# EAGLE schematic Multicell Battery Load Analyzer (EAGLE 9.7.0)

## Sheet 1 of 5
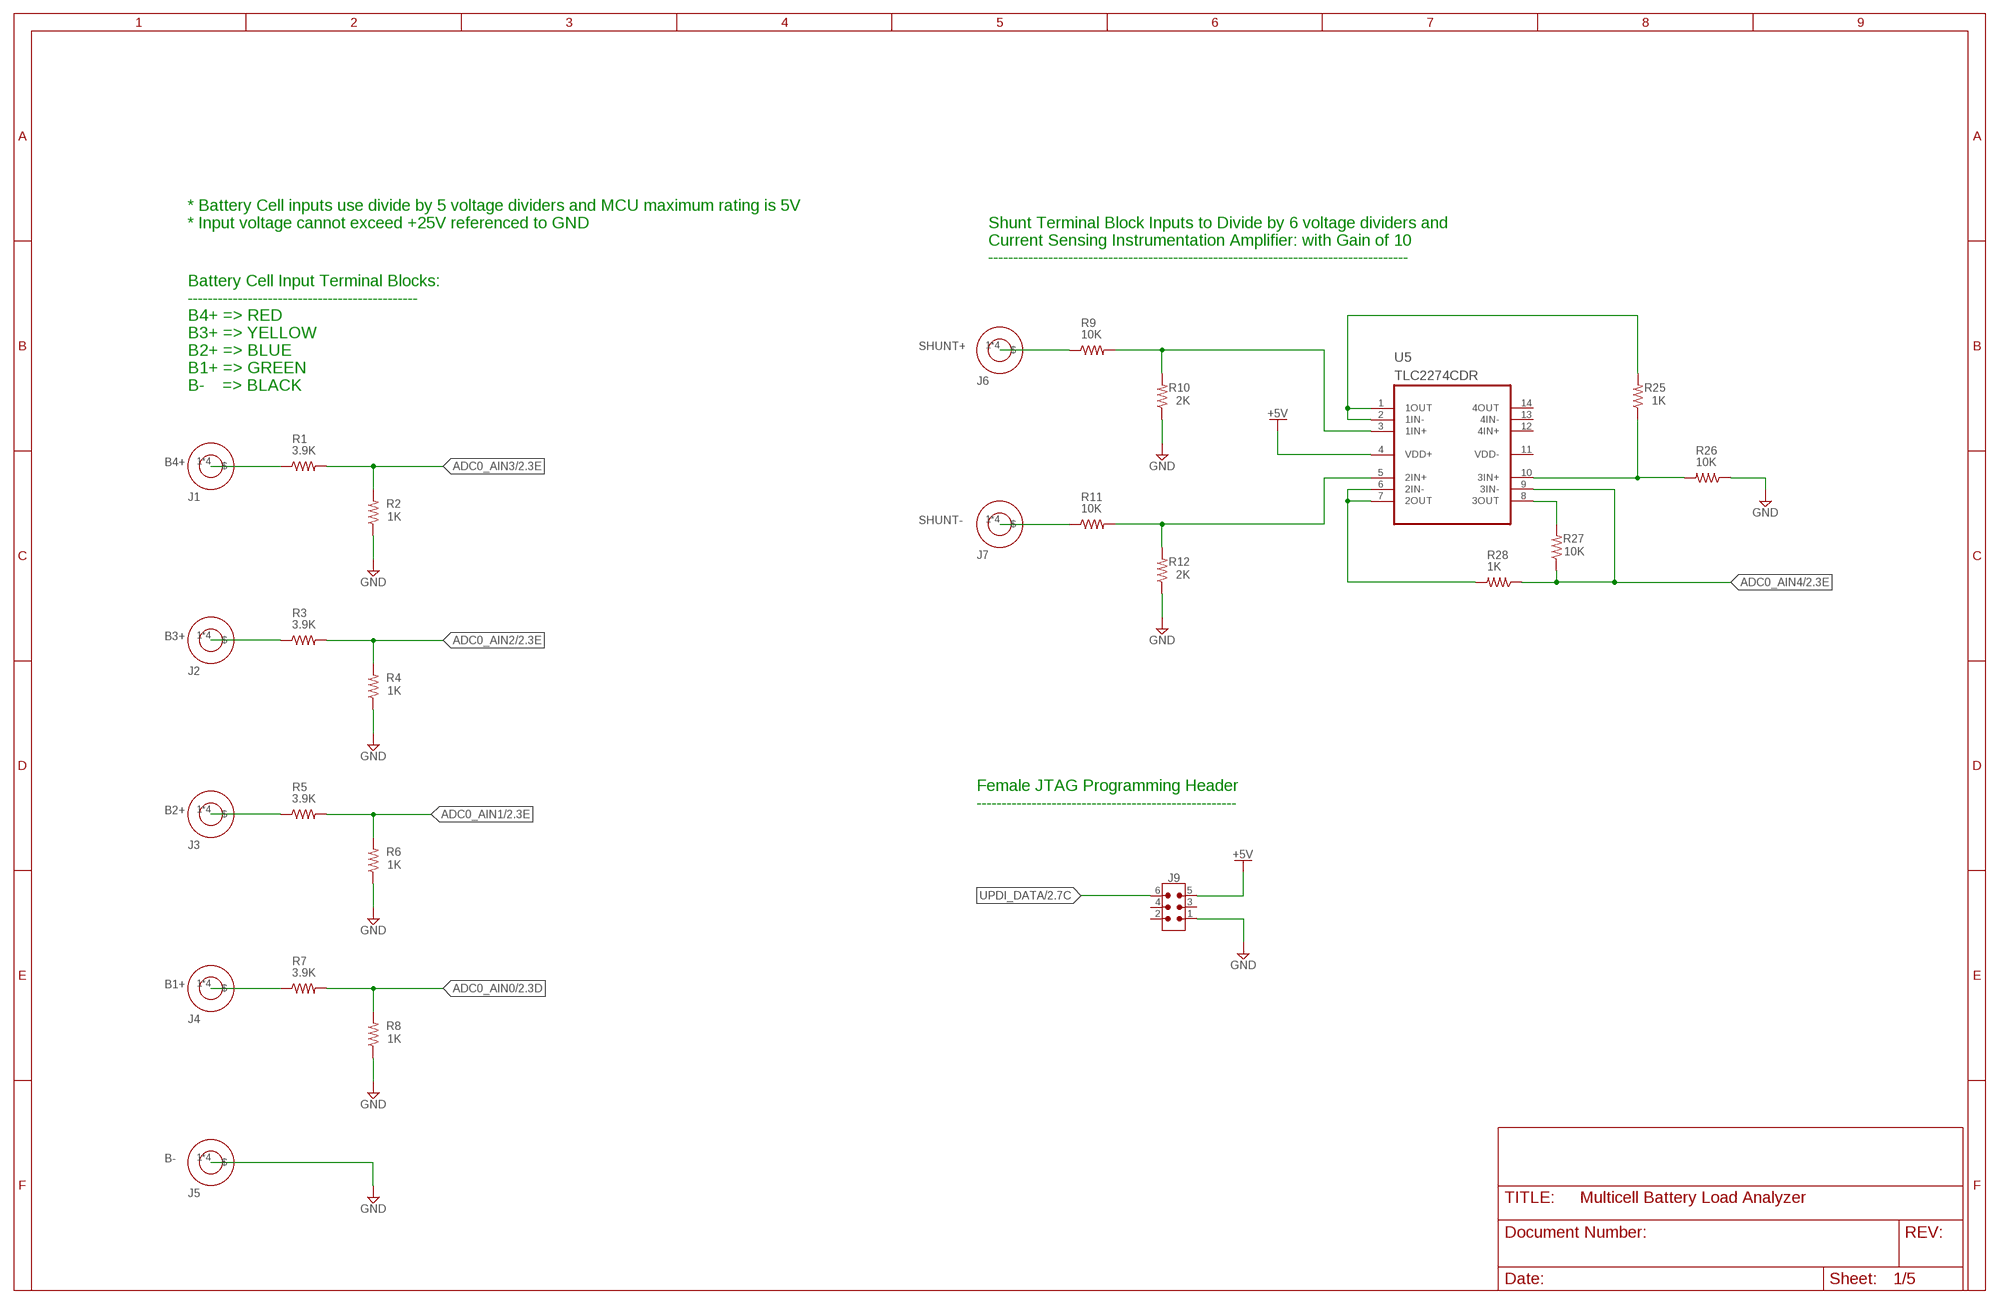
[diagram p0: schematic, sheet 1]

### Parts
J1  7785  [KEYSTONE_7785]
J2  7785  [KEYSTONE_7785]
J3  7785  [KEYSTONE_7785]
J4  7785  [KEYSTONE_7785]
J5  7785  [KEYSTONE_7785]
J6  7785  [KEYSTONE_7785]
J7  7785  [KEYSTONE_7785]
J9  61200621621  6120XX21621_61200621621  [61200621621]
R1  3.9K  R-US_R0805  [R0805]
R2  1K  R-US_R0805  [R0805]
R3  3.9K  R-US_R0805  [R0805]
R4  1K  R-US_R0805  [R0805]
R5  3.9K  R-US_R0805  [R0805]
R6  1K  R-US_R0805  [R0805]
R7  3.9K  R-US_R0805  [R0805]
R8  1K  R-US_R0805  [R0805]
R9  10K  R-US_R0805  [R0805]
R10  2K  R-US_R0805  [R0805]
R11  10K  R-US_R0805  [R0805]
R12  2K  R-US_R0805  [R0805]
R25  1K  R-US_R0805  [R0805]
R26  10K  R-US_R0805  [R0805]
R27  10K  R-US_R0805  [R0805]
R28  1K  R-US_R0805  [R0805]
U5  TLC2274CDR  [SOIC127P600X175-14N]

### Nets
+5V: J9.5 U5.4(VDD+) ; also sheet 2,3,4
ADC0_AIN0: R7.2 R8.2 ; also sheet 2
ADC0_AIN1: R5.2 R6.2 ; also sheet 2
ADC0_AIN2: R3.2 R4.2 ; also sheet 2
ADC0_AIN3: R1.2 R2.2 ; also sheet 2
ADC0_AIN4: R27.1 R28.1 U5.9(3IN-) ; also sheet 2
B1+: J4.1($) J4.2($) J4.3($) J4.4($) R7.1
B2+: J3.1($) J3.2($) J3.3($) J3.4($) R5.1
B3+: J2.1($) J2.2($) J2.3($) J2.4($) R3.1
B4+: J1.1($) J1.2($) J1.3($) J1.4($) R1.1
B-: J5.1($) J5.2($) J5.3($) J5.4($) ; supply symbol labelled GND
GND: J9.1 R2.1 R4.1 R6.1 R8.1 R10.1 R12.1 R26.1 ; also sheet 2,3,4,5
N$11: R9.2 R10.2 U5.3(1IN+)
N$12: R11.2 R12.2 U5.5(2IN+)
N$13: R25.2 U5.1(1OUT) U5.2(1IN-)
N$14: R28.2 U5.6(2IN-) U5.7(2OUT)
N$15: R25.1 R26.2 U5.10(3IN+)
N$19: R27.2 U5.8(3OUT)
SHUNT+: J6.1($) J6.2($) J6.3($) J6.4($) R9.1
SHUNT-: J7.1($) J7.2($) J7.3($) J7.4($) R11.1
UPDI_DATA: J9.6 ; also sheet 2
Unconnected: J9.2 J9.3 J9.4 U5.12(4IN+) U5.13(4IN-) U5.14(4OUT)

### Notes on the sheet
- * Battery Cell inputs use divide by 5 voltage dividers and MCU maximum rating is 5V
  * Input voltage cannot exceed +25V referenced to GND
- Shunt Terminal Block Inputs to Divide by 6 voltage dividers and 
  Current Sensing Instrumentation Amplifier: with Gain of 10
  ------------------------------------------------------------------------------------
- Battery Cell Input Terminal Blocks:
  ----------------------------------------------
  B4+ => RED
  B3+ => YELLOW
  B2+ => BLUE
  B1+ => GREEN
  B-    => BLACK
- Female JTAG Programming Header
  ----------------------------------------------------

## Sheet 2 of 5
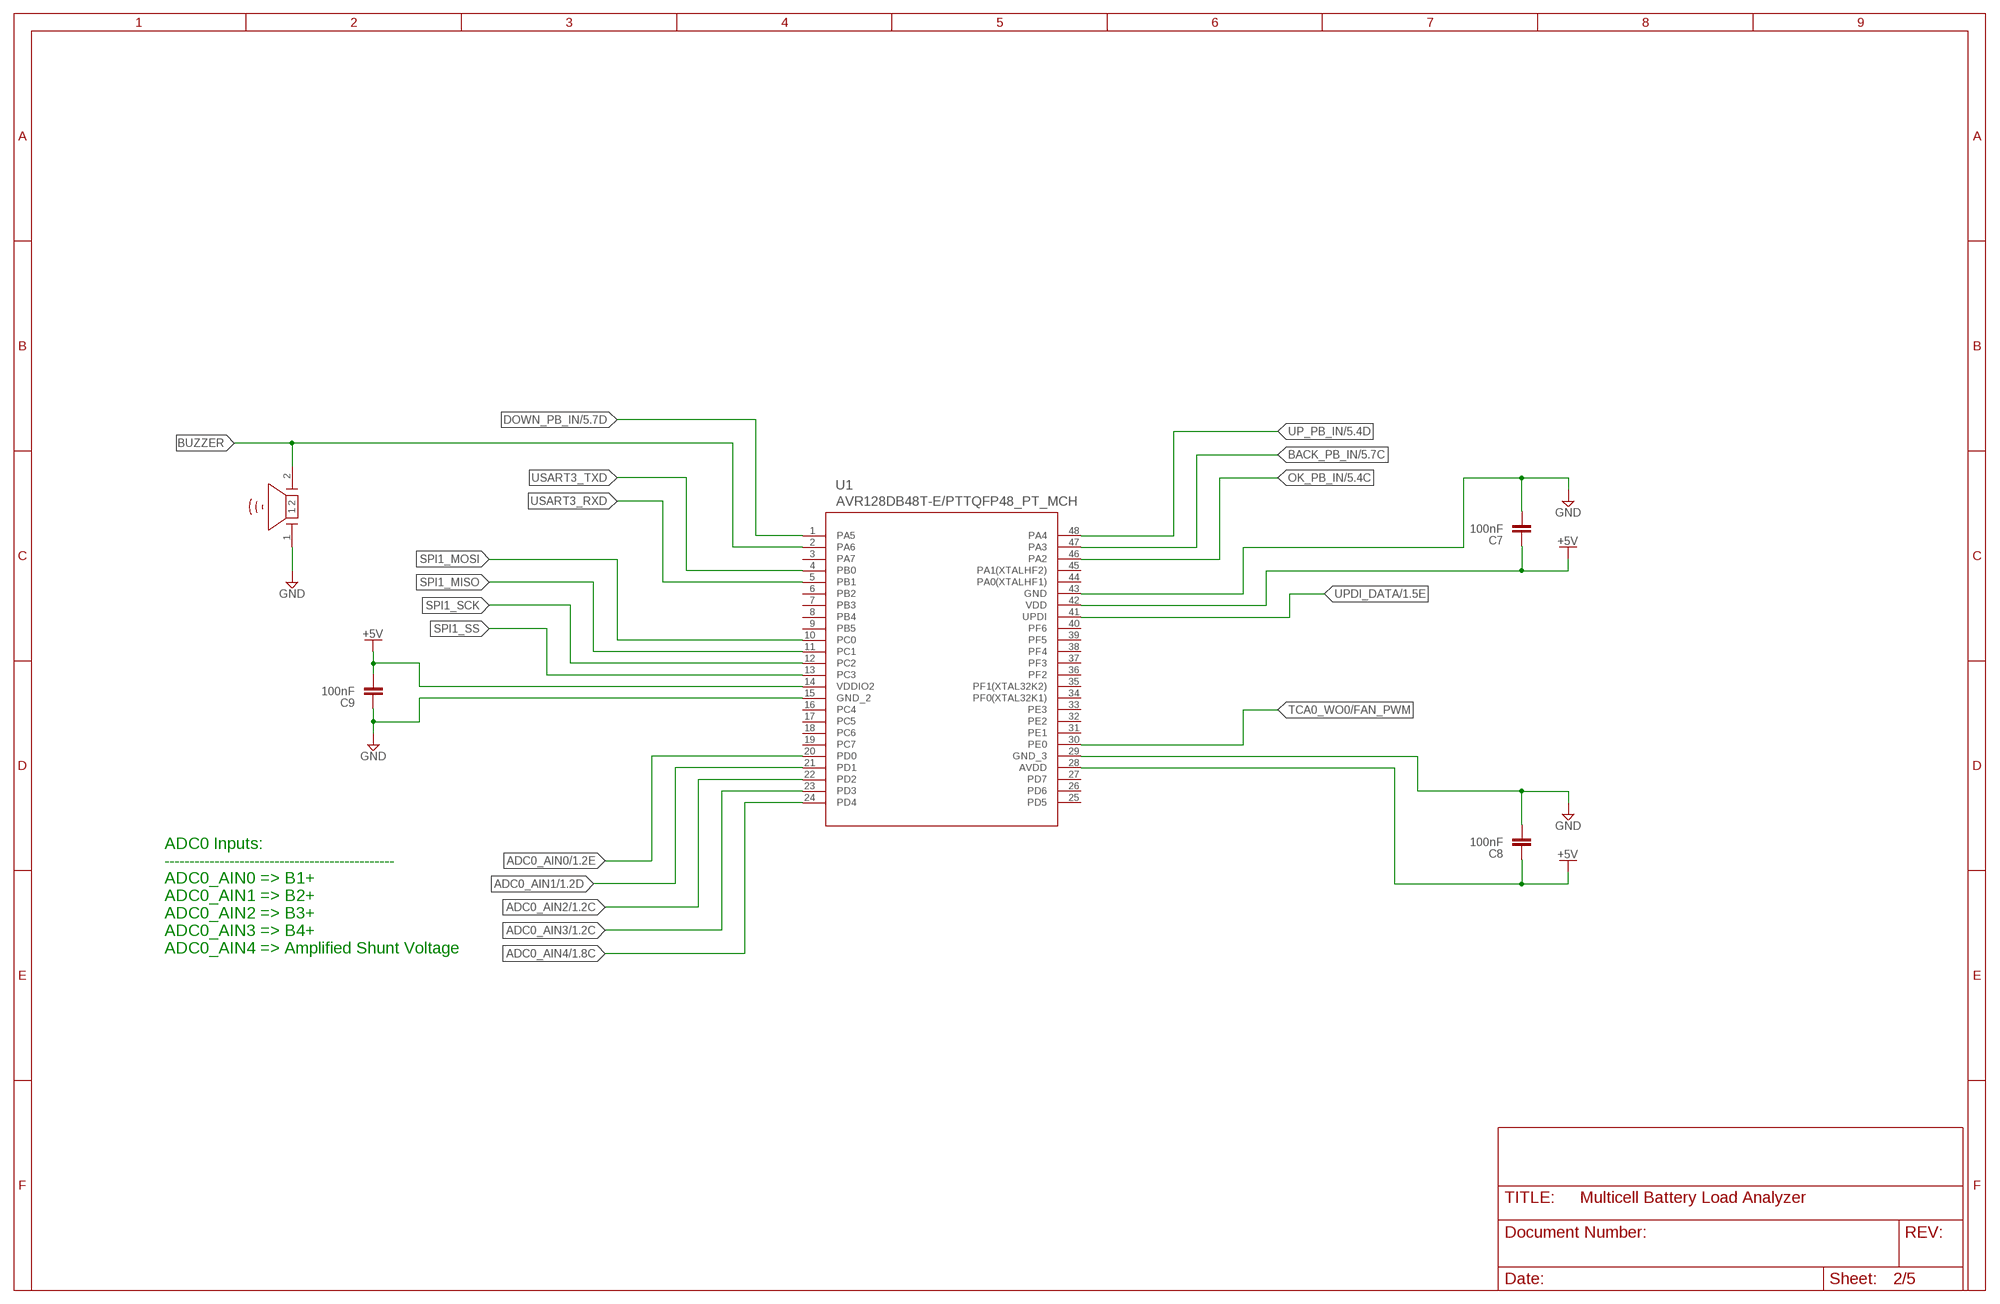
[diagram p1: schematic, sheet 2]

### Parts
C7  100nF  C-EUC0805  [C0805]
C8  100nF  C-EUC0805  [C0805]
C9  100nF  C-EUC0805  [C0805]
LS1  PIEZO  [PIEZO]
U1  AVR128DB48T-E/PTTQFP48_PT_MCH  [TQFP48_PT_MCH]

### Nets
+5V: C7.1 C8.1 C9.2 U1.14(VDDIO2) U1.28(AVDD) U1.42(VDD) ; also sheet 1,3,4
ADC0_AIN0: U1.20(PD0) ; also sheet 1
ADC0_AIN1: U1.21(PD1) ; also sheet 1
ADC0_AIN2: U1.22(PD2) ; also sheet 1
ADC0_AIN3: U1.23(PD3) ; also sheet 1
ADC0_AIN4: U1.24(PD4) ; also sheet 1
BACK_PB_IN: U1.47(PA3) ; also sheet 5
BUZZER: LS1.2 U1.2(PA6)
DOWN_PB_IN: U1.1(PA5) ; also sheet 5
GND: C7.2 C8.2 C9.1 LS1.1 U1.15(GND_2) U1.29(GND_3) U1.43(GND) ; also sheet 1,3,4,5
OK_PB_IN: U1.46(PA2) ; also sheet 5
SPI1_MISO: U1.11(PC1)
SPI1_MOSI: U1.10(PC0)
SPI1_SCK: U1.12(PC2)
SPI1_SS: U1.13(PC3)
TCA0_WO0/FAN_PWM: U1.30(PE0)
UP_PB_IN: U1.48(PA4) ; also sheet 5
UPDI_DATA: U1.41(UPDI) ; also sheet 1
USART3_RXD: U1.5(PB1)
USART3_TXD: U1.4(PB0)
Unconnected: U1.3(PA7) U1.6(PB2) U1.7(PB3) U1.8(PB4) U1.9(PB5) U1.16(PC4) U1.17(PC5) U1.18(PC6) U1.19(PC7) U1.25(PD5) U1.26(PD6) U1.27(PD7) U1.31(PE1) U1.32(PE2) U1.33(PE3) U1.34(PF0(XTAL32K1)) U1.35(PF1(XTAL32K2)) U1.36(PF2) U1.37(PF3) U1.38(PF4) U1.39(PF5) U1.40(PF6) U1.44(PA0(XTALHF1)) U1.45(PA1(XTALHF2))

### Notes on the sheet
- ADC0 Inputs:
  ----------------------------------------------
  ADC0_AIN0 => B1+
  ADC0_AIN1 => B2+
  ADC0_AIN2 => B3+
  ADC0_AIN3 => B4+
  ADC0_AIN4 => Amplified Shunt Voltage

## Sheet 3 of 5
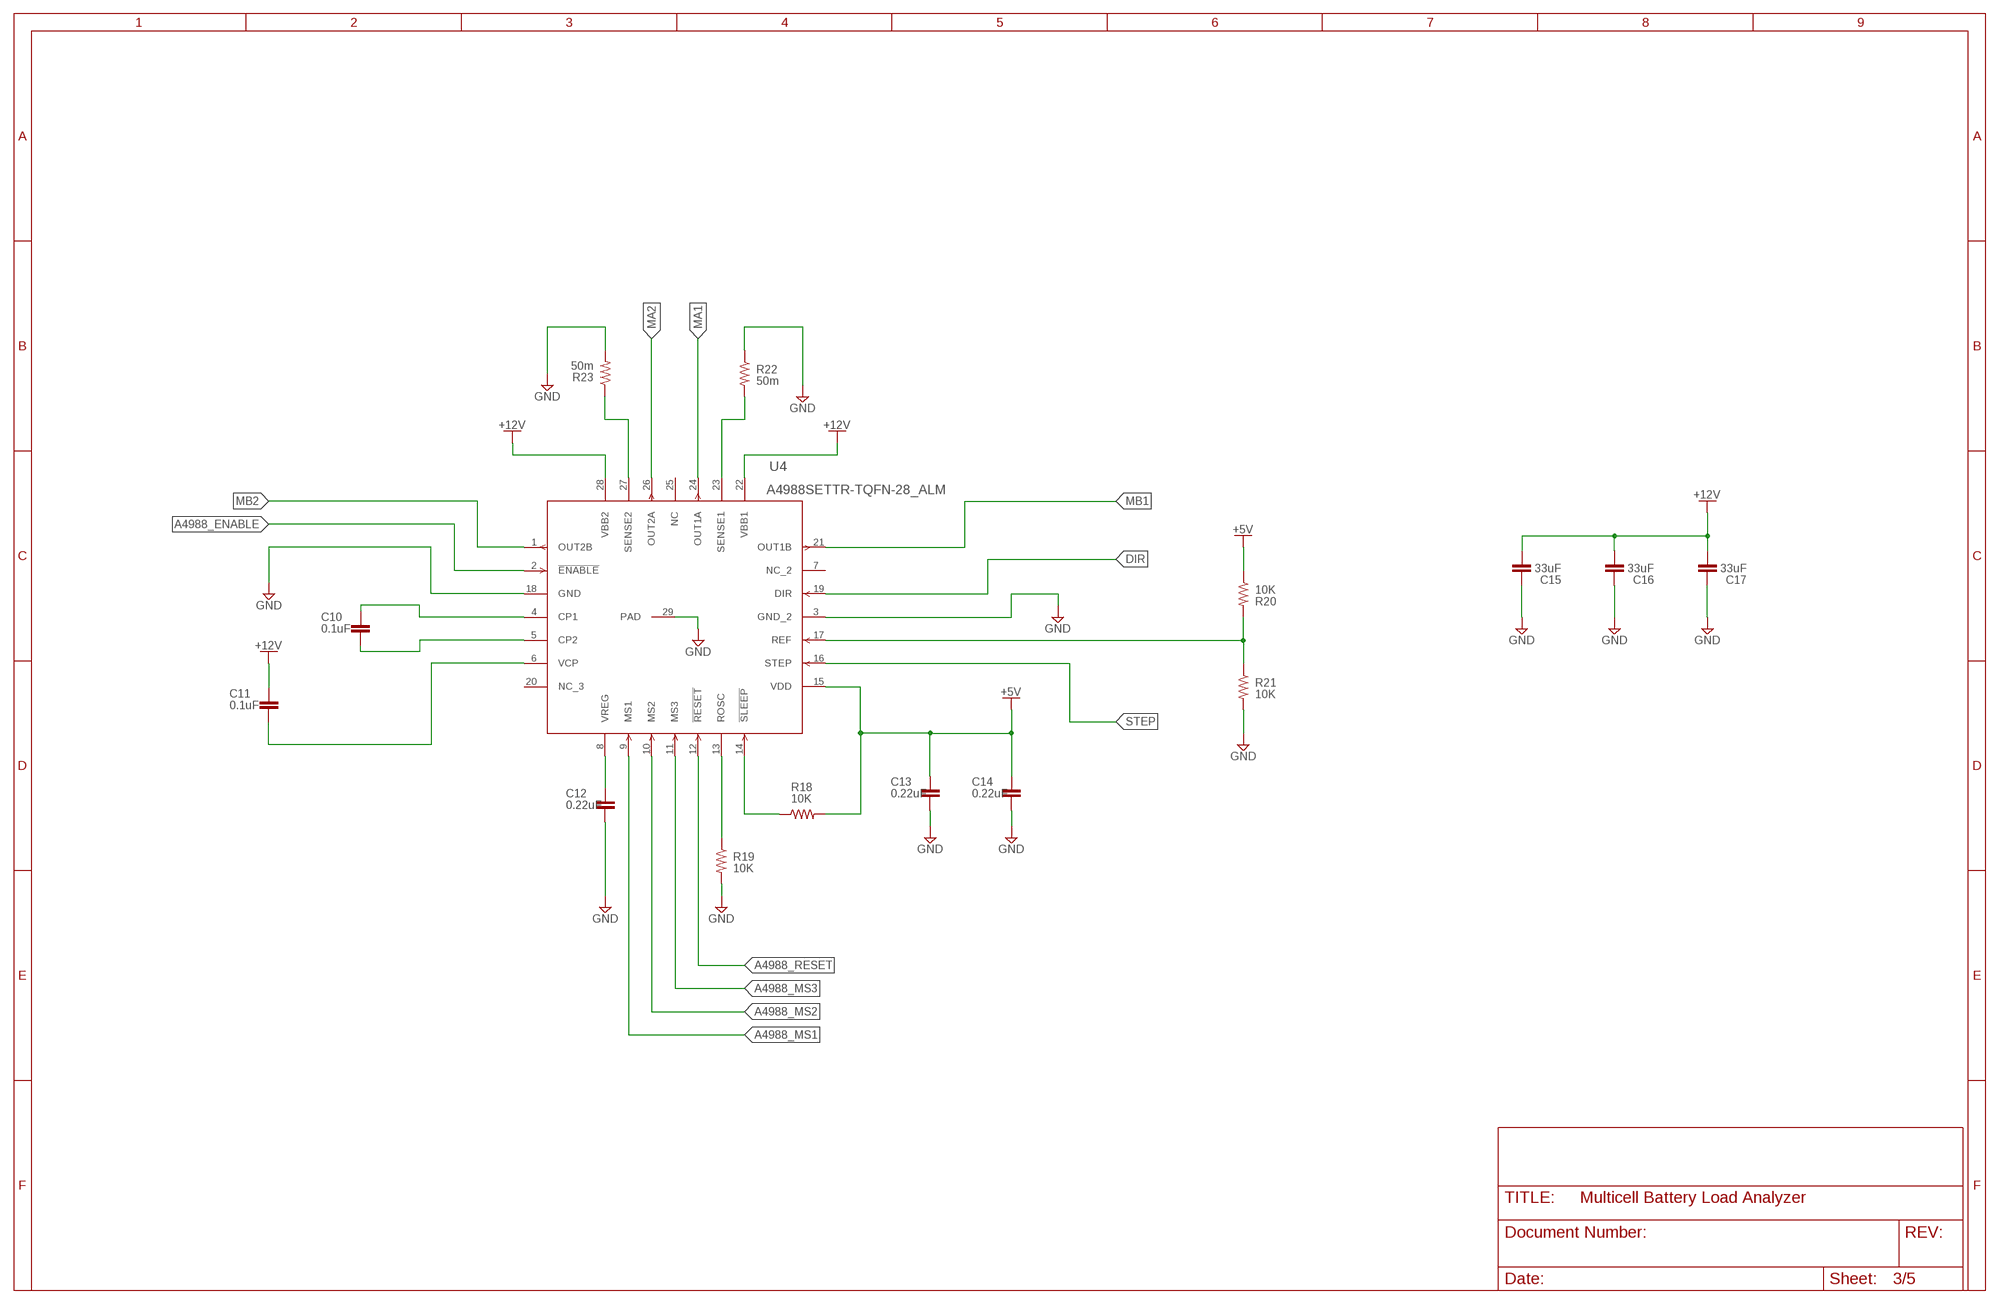
[diagram p2: schematic, sheet 3]

### Parts
C10  0.1uF  C-EUC0805  [C0805]
C11  0.1uF  C-EUC0805  [C0805]
C12  0.22uF  C-EUC0805  [C0805]
C13  0.22uF  C-EUC0805  [C0805]
C14  0.22uF  C-EUC0805  [C0805]
C15  33uF  C-EUC0805  [C0805]
C16  33uF  C-EUC0805  [C0805]
C17  33uF  C-EUC0805  [C0805]
R18  10K  R-US_R0805  [R0805]
R19  10K  R-US_R0805  [R0805]
R20  10K  R-US_R0805  [R0805]
R21  10K  R-US_R0805  [R0805]
R22  50m  R-US_R0805  [R0805]
R23  50m  R-US_R0805  [R0805]
U4  A4988SETTR-TQFN-28_ALM  [QFN-28_ALM]

### Nets
+5V: C13.1 C14.1 R18.2 R20.1 U4.15(VDD) ; also sheet 1,2,4
+12V: C11.1 C15.2 C16.2 C17.2 U4.22(VBB1) U4.28(VBB2) ; also sheet 4
A4988_ENABLE: U4.2(!ENABLE)
A4988_MS1: U4.9(MS1)
A4988_MS2: U4.10(MS2)
A4988_MS3: U4.11(MS3)
A4988_RESET: U4.12(!RESET)
DIR: U4.19(DIR)
GND: C12.2 C13.2 C14.2 C15.1 C16.1 C17.1 R19.2 R21.2 R22.1 R23.2 U4.3(GND_2) U4.18(GND) U4.29(PAD) ; also sheet 1,2,4,5
MA1: U4.24(OUT1A)
MA2: U4.26(OUT2A)
MB1: U4.21(OUT1B)
MB2: U4.1(OUT2B)
N$8: C10.1 U4.4(CP1)
N$9: C10.2 U4.5(CP2)
N$16: R19.1 U4.13(ROSC)
N$17: R18.1 U4.14(!SLEEP)
N$18: C12.1 U4.8(VREG)
N$20: R23.1 U4.27(SENSE2)
N$21: R22.2 U4.23(SENSE1)
N$27: R20.2 R21.1 U4.17(REF)
N$29: C11.2 U4.6(VCP)
STEP: U4.16(STEP)
Unconnected: U4.7(NC_2) U4.20(NC_3) U4.25(NC)

## Sheet 4 of 5
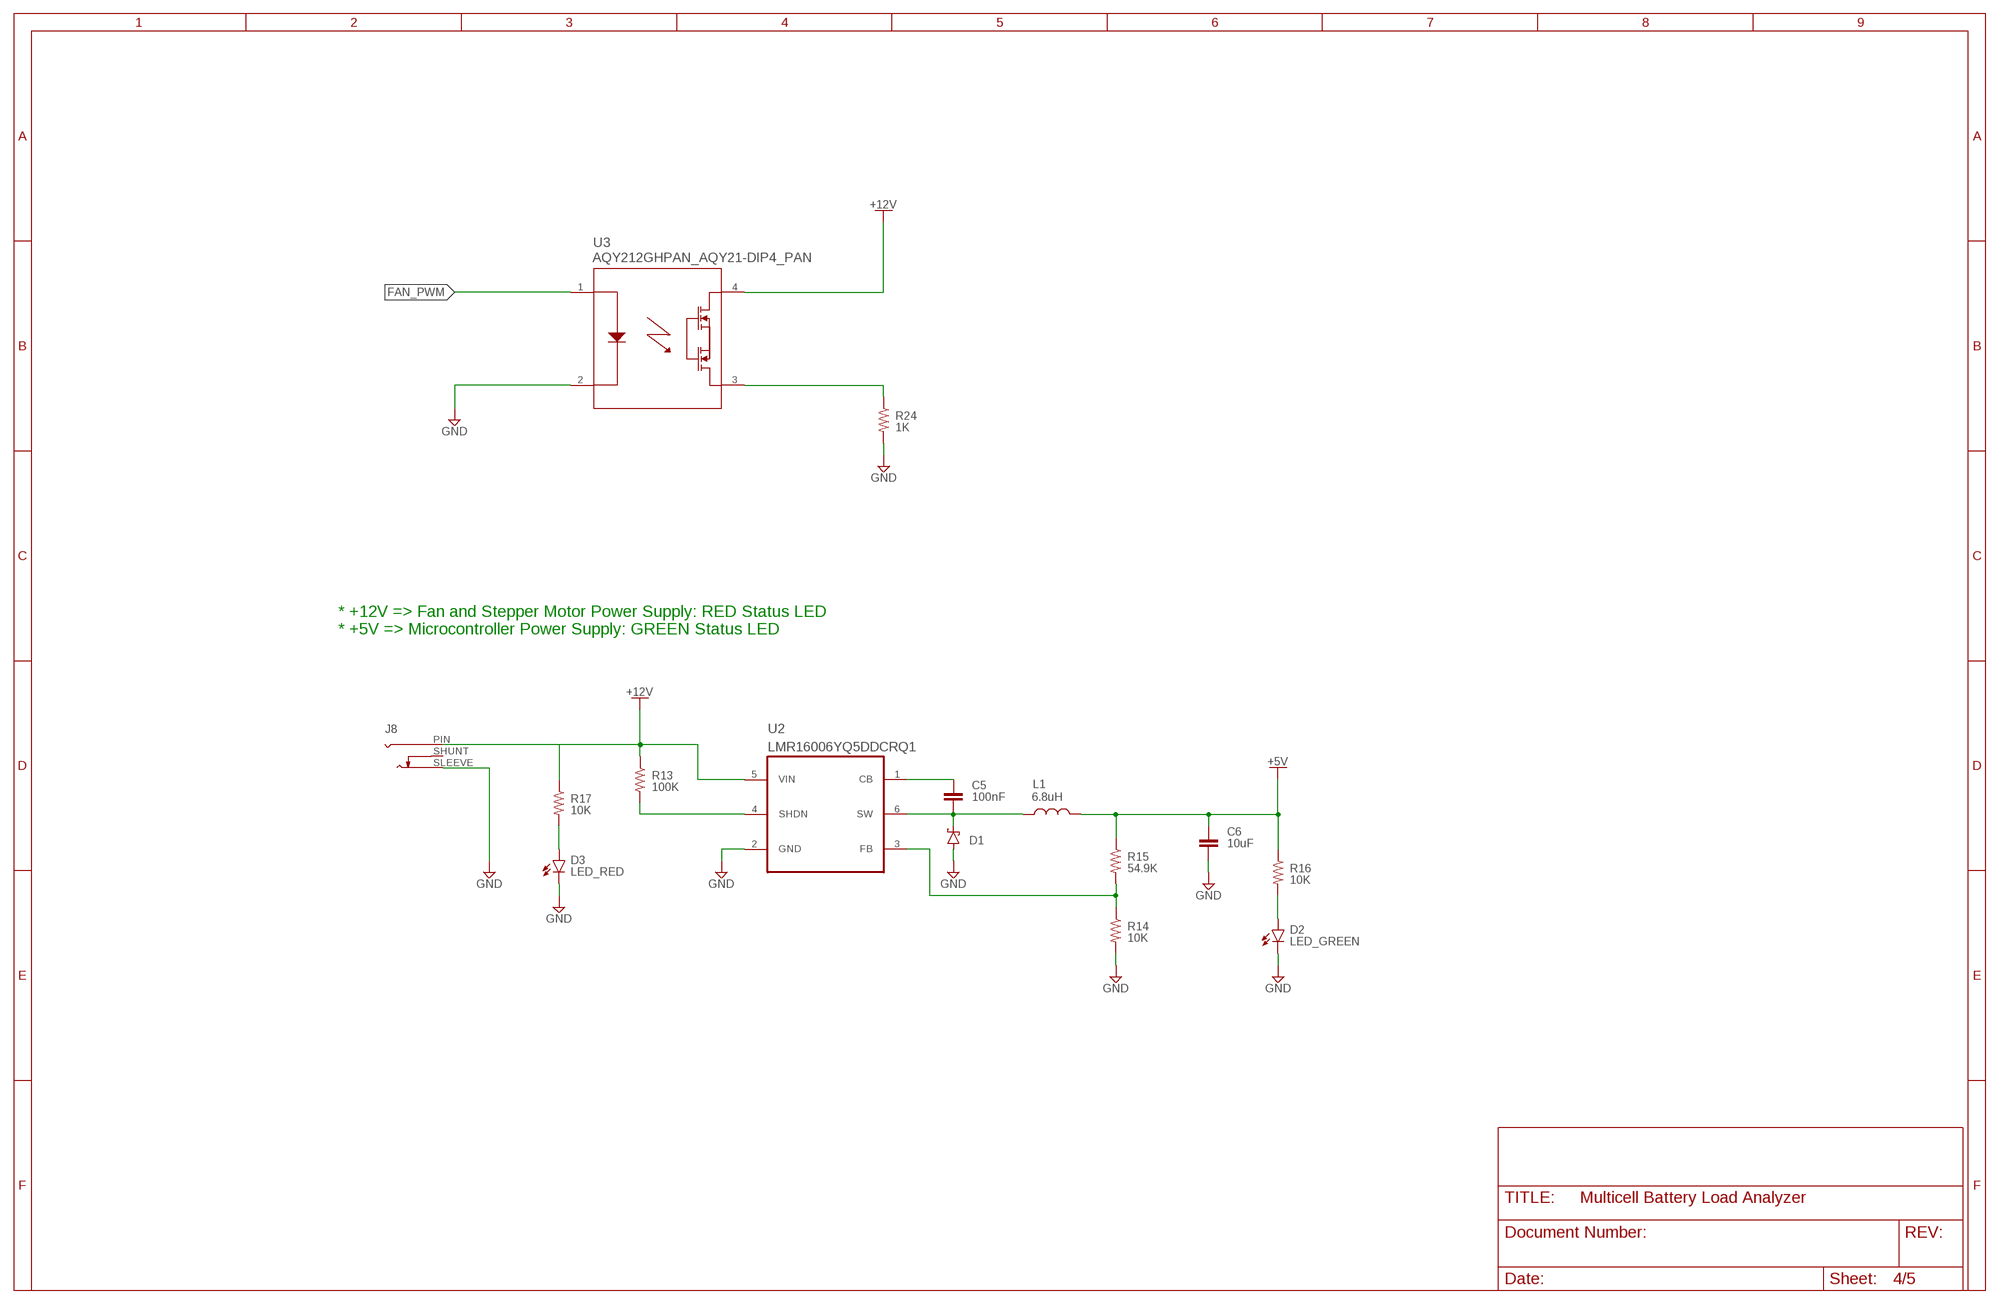
[diagram p3: schematic, sheet 4]

### Parts
C5  100nF  C-EUC0805  [C0805]
C6  10uF  C-EUC0805  [C0805]
D1  MBR0520LT1G  SCHOTTKY_MBR0520LT1GDO-219  [SODFL3718X115]
D2  LED_GREEN  CHIP-FLAT-G_0805  [LEDC2012X110N_FLAT-G]
D3  LED_RED  CHIP-FLAT-R_0805  [LEDC2012X110N_FLAT-R]
J8  RASM712BKZ  [SWITCHCRAFT_RASM712BKZ]
L1  6.8uH  L_CHIP-0805(2012-METRIC)  [INDC2009X120]
R13  100K  R-US_R0805  [R0805]
R14  10K  R-US_R0805  [R0805]
R15  54.9K  R-US_R0805  [R0805]
R16  10K  R-US_R0805  [R0805]
R17  10K  R-US_R0805  [R0805]
R24  1K  R-US_R0805  [R0805]
U2  LMR16006YQ5DDCRQ1  [SOT95P280X110-6N]
U3  AQY212GHPAN_AQY21-DIP4_PAN  [PAN_AQY21-DIP4_PAN]

### Nets
+5V: C6.1 L1.2 R15.1 R16.1 ; also sheet 1,2,3
+5V1: R17.1
+12V: J8.PIN R13.1 U2.5(VIN) U3.4 ; also sheet 3
FAN_PWM: U3.1
GND: C6.2 D1.2(A) D2.C D3.C R14.2 R24.2 U2.2(GND) U3.2 ; also sheet 1,2,3,5
N$1: J8.SLEEVE ; supply symbol labelled GND ; also sheet 5
N$2: R13.2 U2.4(SHDN)
N$3: C5.1 U2.1(CB)
N$4: C5.2 D1.1(C) L1.1 U2.6(SW)
N$5: R14.1 R15.2 U2.3(FB)
N$6: D2.A R16.2
N$7: D3.A R17.2
N$10: R24.1 U3.3
Unconnected: J8.SHUNT

### Notes on the sheet
- * +12V => Fan and Stepper Motor Power Supply: RED Status LED
  * +5V => Microcontroller Power Supply: GREEN Status LED

## Sheet 5 of 5
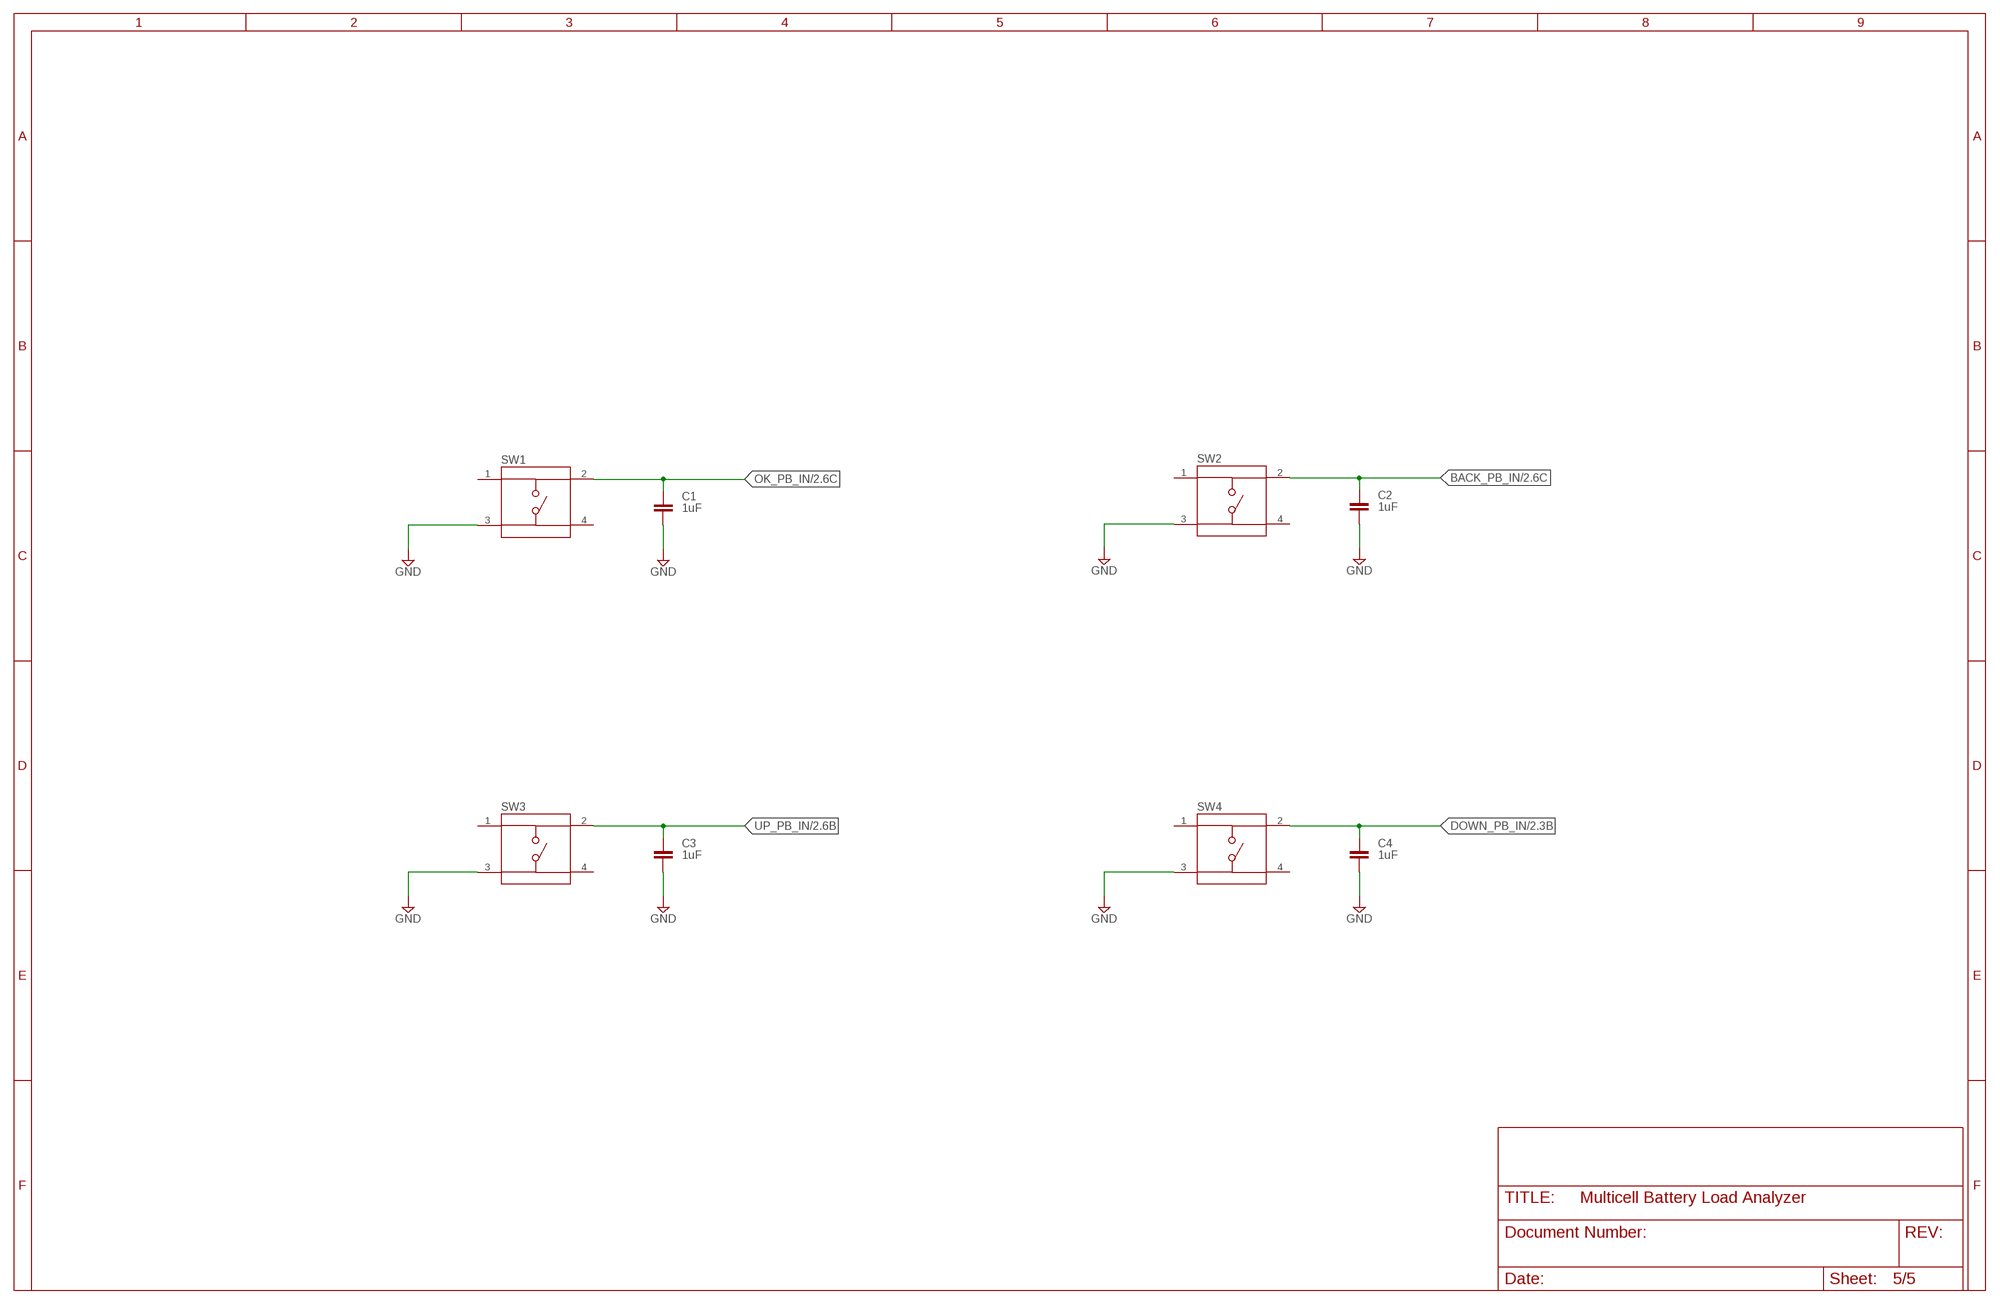
[diagram p4: schematic, sheet 5]

### Parts
C1  1uF  C-EUC0805  [C0805]
C2  1uF  C-EUC0805  [C0805]
C3  1uF  C-EUC0805  [C0805]
C4  1uF  C-EUC0805  [C0805]
SW1  TS02-66-43-BK-100-LCR-D  [SW_TS02-66-43-BK-100-LCR-D]
SW2  TS02-66-43-BK-100-LCR-D  [SW_TS02-66-43-BK-100-LCR-D]
SW3  TS02-66-43-BK-100-LCR-D  [SW_TS02-66-43-BK-100-LCR-D]
SW4  TS02-66-43-BK-100-LCR-D  [SW_TS02-66-43-BK-100-LCR-D]

### Nets
BACK_PB_IN: C2.1 SW2.2 ; also sheet 2
DOWN_PB_IN: C4.1 SW4.2 ; also sheet 2
GND: C1.2 C2.2 C3.2 C4.2 ; also sheet 1,2,3,4
N$1: SW1.3 SW2.3 SW3.3 SW4.3 ; supply symbol labelled GND ; also sheet 4
OK_PB_IN: C1.1 SW1.2 ; also sheet 2
UP_PB_IN: C3.1 SW3.2 ; also sheet 2
Unconnected: SW1.1 SW1.4 SW2.1 SW2.4 SW3.1 SW3.4 SW4.1 SW4.4

## Power pins joined to a net without a drawn wire
VDD-: U5.11(VDD-)

## Library data of the parts
C1-C17 = rcl:C-EU: CAPACITOR, European symbol; SPICEPREFIX: C
D1 = Diode:SCHOTTKY_: Schottky Diode - Popular parts; CATEGORY: Diode; DESCRIPTION: DIODE SCHOTTKY 20V 500MA SOD123; MANUFACTURER: ON Semiconductor; MPN: MBR0520LT1G; SUB-CATEGORY: Schottky
D2 = LED:CHIP-FLAT-G; CATEGORY: LED; COLOR: GREEN; DESCRIPTION: CHIP LED FLAT; SUB-CATEGORY: CHIP; TYPE: FLAT_TOP
D3 = LED:CHIP-FLAT-R; CATEGORY: LED; COLOR: RED; DESCRIPTION: CHIP LED FLAT; SUB-CATEGORY: CHIP; TYPE: FLAT_TOP
J1-J7 = Multicell Battery Load Analyzer Components:7785; MANUFACTURER: Keystone Electronics; MAXIMUM_PACKAGE_HEIGHT: 6.575 mm; PARTREV: D; STANDARD: Manufacturer Recommendations
J8 = Multicell Battery Load Analyzer Components:RASM712BKZ: Power Barrel Connector Jack 2.50mm ID (0.098"), 5.50mm OD (0.217") Surface Mount, Right Angle; MANUFACTURER: Switchcraft; MAXIMUM_PACKAGE_HEIGHT: 11.11 mm; PARTREV: C; STANDARD: Manufacturer Recommendations
J9 = Multicell Battery Load Analyzer Components:6120XX21621_61200621621: WR-BHD 2.54 mm Male Box Header KIND PROPERTIES: Pitch 2.54 mm Gender:Male MATERIAL PROPERTIES: Insulator Material:PBT Insulator Flammability Rating UL94 V-0 Insulator Color:Black Contact Material :Copper Alloy Contact Plating :Gold Contact Type: Stamped GENERAL INFORMATION: Operating Temperature:-40 °C up to +125 °C Compliance:RoHS Working Voltage: 250 V (AC) Withstanding Voltage:500 V (AC) Contact Resistance: 20 mΩ Insulation Resistance:1000 MΩ CERTIFICATION: UL Approval:E323964 PACKAGING PROPERTIES Packaging :Tray <https://www.we-online.com/catalog/media/o32884v209%20Family_WR-BHD_6120xx21621.jpg> Details see: https://www.we-online.com/catalog/en/BHD_2_54_MALE_BOX_HEADER_6120XX21621 Updated by Ella Wu 2021-3-12 2021 (C) Würth Elektronik; CONTACT-RESISTANCE: 20mOhm; DATASHEET-URL: https://www.we-online.com/redexpert/spec/61200621621?ae; GENDER: Male; IR: 3A; LENGTH: 15.28mm; MOUNT: THT; PACKAGING: Tray; PART-NUMBER: 61200621621; PINS: 6; PITCH: 2.54mm; TYPE: Straight; WORKING-VOLTAGE: 250V(AC)
L1 = Inductor:L: Inductor Fixed - Generic; CATEGORY: Inductor; SUB-CATEGORY: Fixed
LS1 = Tinkercad:PIEZO: Piezoelectric Sounders / Buzzers Reference Datasheet <https://www.murata.com/products/productdata/8801054621726/SPEC-PKM17EPPH4001-B0.pdf?1517839212000>
R1-R28 = rcl:R-US_: RESISTOR, American symbol; SPICEPREFIX: R
SW1-SW4 = Multicell Battery Load Analyzer Components:TS02-66-43-BK-100-LCR-D; MANUFACTURER: CUI Devices; PARTREV: 1.0; STANDARD: Manufacturer Recommendations
U1 = Multicell Battery Load Analyzer Components:AVR128DB48T-E/PT; COPYRIGHT: Copyright (C) 2024 Ultra Librarian. All rights reserved.; MANUFACTURER_PART_NUMBER: AVR128DB48T-E/PT; MFR_NAME: Microchip
U2 = Multicell Battery Load Analyzer Components:LMR16006YQ5DDCRQ1
U3 = Multicell Battery Load Analyzer Components:AQY212GH; COPYRIGHT: Copyright (C) 2025 Ultra Librarian. All rights reserved.; MANUFACTURER_PART_NUMBER: AQY212GH; MFR_NAME: Panasonic
U4 = Multicell Battery Load Analyzer Components:A4988SETTR-T; COPYRIGHT: Copyright (C) 2025 Ultra Librarian. All rights reserved.; MANUFACTURER_PART_NUMBER: A4988SETTR-T; MFR_NAME: Allegro Microsystems Inc.
U5 = Multicell Battery Load Analyzer Components:TLC2274CDR